# Altium schematic sheet ICs.SchDoc
size OrCAD C
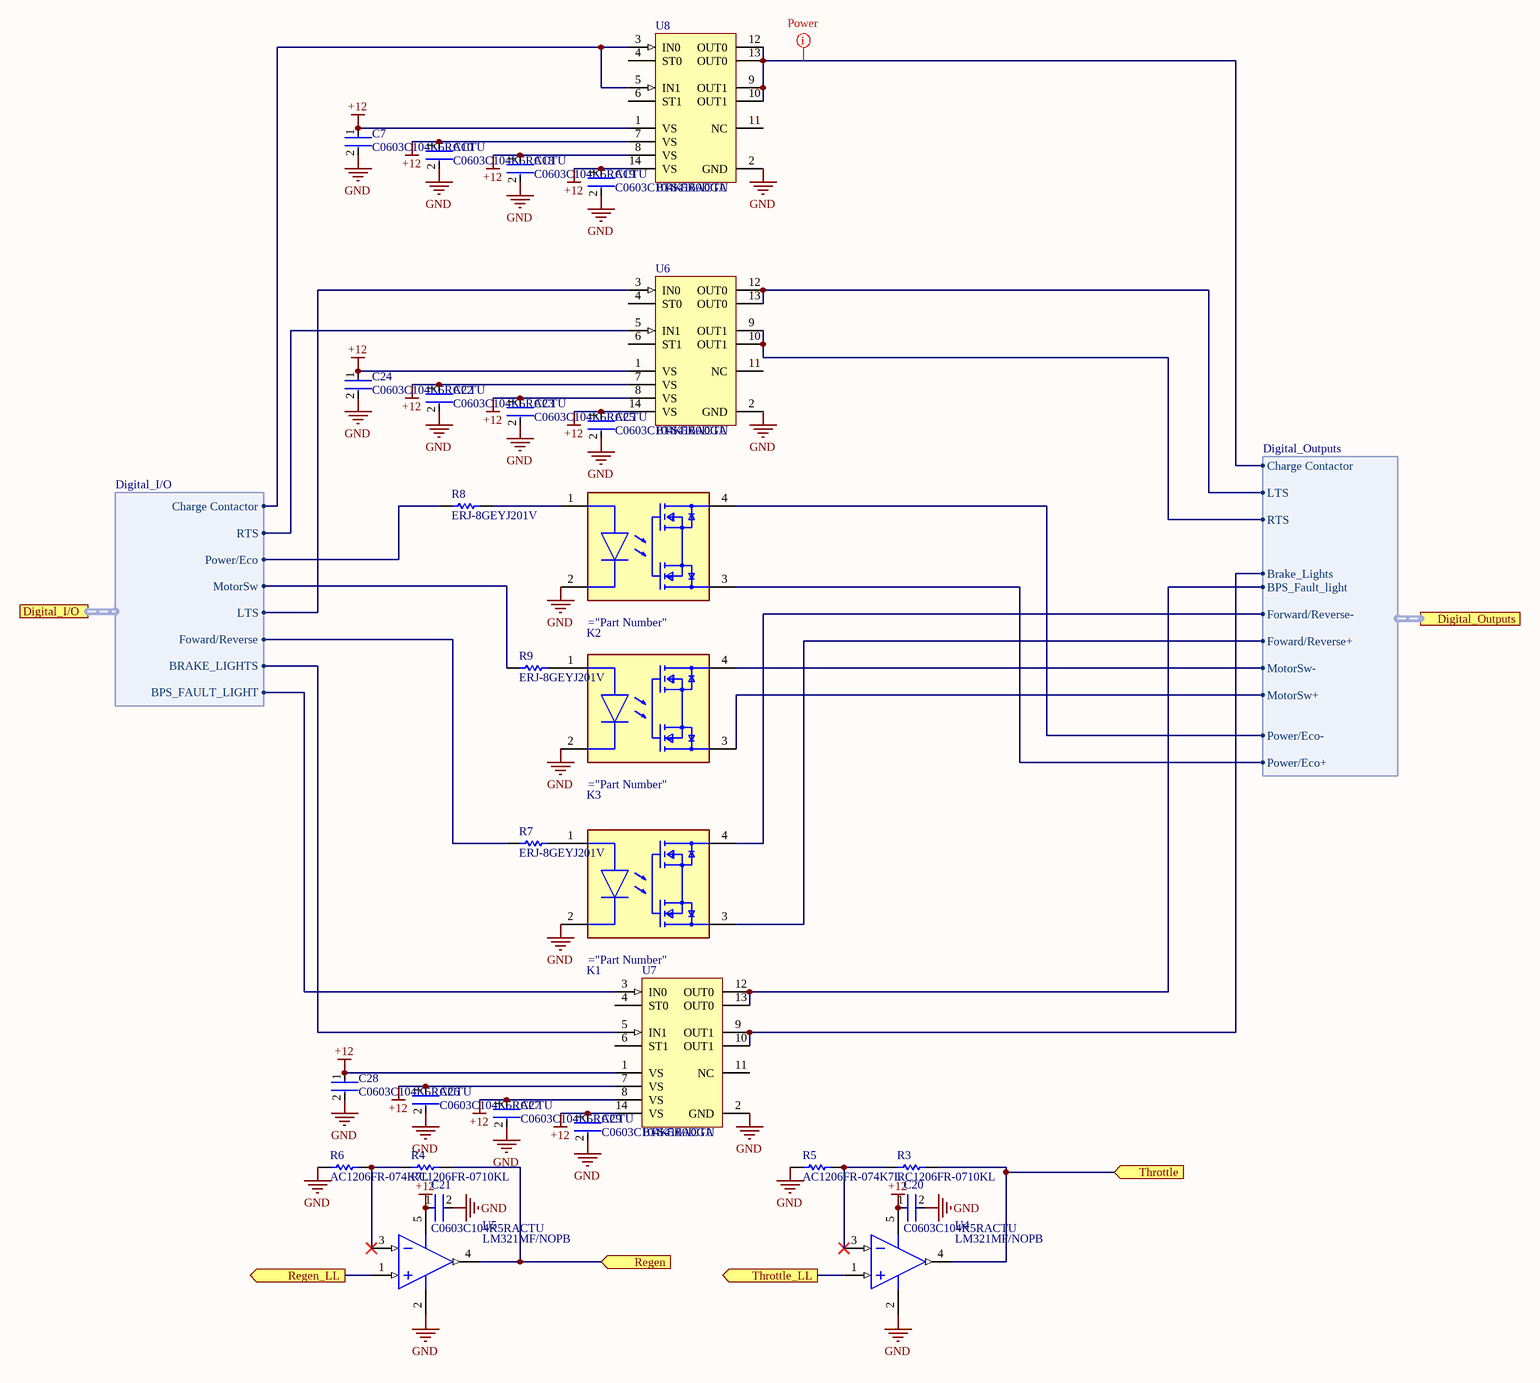
[diagram p0: ICs.SchDoc]

## Parts
C7  C0603C104K5RACTU  [Kemet_C0603_IPC_A]
C10  C0603C104K5RACTU  [Kemet_C0603_IPC_A]
C18  C0603C104K5RACTU  [Kemet_C0603_IPC_A]
C19  C0603C104K5RACTU  [Kemet_C0603_IPC_A]
C20  C0603C104K5RACTU  [Kemet_C0603_IPC_A]
C21  C0603C104K5RACTU  [Kemet_C0603_IPC_A]
C22  C0603C104K5RACTU  [Kemet_C0603_IPC_A]
C23  C0603C104K5RACTU  [Kemet_C0603_IPC_A]
C24  C0603C104K5RACTU  [Kemet_C0603_IPC_A]
C25  C0603C104K5RACTU  [Kemet_C0603_IPC_A]
C26  C0603C104K5RACTU  [Kemet_C0603_IPC_A]
C27  C0603C104K5RACTU  [Kemet_C0603_IPC_A]
C28  C0603C104K5RACTU  [Kemet_C0603_IPC_A]
C29  C0603C104K5RACTU  [Kemet_C0603_IPC_A]
K1  TLP3123_F  [Toshiba_11-5H1_0]  (value not drawn)
K2  TLP3123_F  [Toshiba_11-5H1_0]  (value not drawn)
K3  TLP3123_F  [Toshiba_11-5H1_0]  (value not drawn)
R3  RC1206FR-0710KL  [RESC3116X65X40ML10T20]
R4  RC1206FR-0710KL  [RESC3116X65X40ML10T20]
R5  AC1206FR-074K7L  [RESC3116X65X45NL10T20]
R6  AC1206FR-074K7L  [RESC3116X65X45NL10T20]
R7  ERJ-8GEYJ201V  [RESC3216X70X50LL05T20]
R8  ERJ-8GEYJ201V  [RESC3216X70X50LL05T20]
R9  ERJ-8GEYJ201V  [RESC3216X70X50LL05T20]
U4  LM321MF/NOPB  [DBV0005A_L]
U5  LM321MF/NOPB  [DBV0005A_L]
U6  BTS4160DGA  [INF-PG-DSO-14-37_N]
U7  BTS4160DGA  [INF-PG-DSO-14-37_N]
U8  BTS4160DGA  [INF-PG-DSO-14-37_N]

## Ports
Digital_I/O (harness Digital_I/O), Digital_Outputs (harness Digital_Outputs), Regen (in), Regen_LL (out), Throttle (in), Throttle_LL (out)

## Harnesses
Digital_I/O: BPS_FAULT_LIGHT, BRAKE_LIGHTS, Foward/Reverse, LTS, MotorSw, Power/Eco, RTS, Charge Contactor
Digital_Outputs: LTS, RTS, Power/Eco+, Power/Eco-, MotorSw+, MotorSw-, Foward/Reverse+, Forward/Reverse-, Brake_Lights, BPS_Fault_light, Charge Contactor

## Nets
+12: C7.1 C10.1 C18.1 C19.1 C20.1 C21.1 C22.1 C23.1 C24.1 C25.1 C26.1 C27.1 C28.1 C29.1 U4.5(V+) U5.5(V+) U6.1(VS) U6.7(VS) U6.8(VS) U6.14(VS) U7.1(VS) U7.7(VS) U7.8(VS) U7.14(VS) U8.1(VS) U8.7(VS) U8.8(VS) U8.14(VS)
GND: C7.2 C10.2 C18.2 C19.2 C20.2 C21.2 C22.2 C23.2 C24.2 C25.2 C26.2 C27.2 C28.2 C29.2 K1.2(C) K2.2(C) K3.2(C) R5.1 R6.1 U4.2(V-) U5.2(V-) U6.2(GND) U7.2(GND) U8.2(GND)
Regen: R4.2 U5.4(OUT) ; port Regen
Regen_LL: U5.1(IN+) ; port Regen_LL
Throttle: R3.2 U4.4(OUT) ; port Throttle
Throttle_LL: U4.1(IN+) ; port Throttle_LL
NetK1_1: K1.1(A) R7.2
NetK1_3: K1.3(1_DRAIN) ; port Digital_Outputs.Foward/Reverse+
NetK1_4: K1.4(2_DRAIN) ; port Digital_Outputs.Forward/Reverse-
NetK2_1: K2.1(A) R8.2
NetK2_3: K2.3(1_DRAIN) ; port Digital_Outputs.Power/Eco+
NetK2_4: K2.4(2_DRAIN) ; port Digital_Outputs.Power/Eco-
NetK3_1: K3.1(A) R9.2
NetK3_3: K3.3(1_DRAIN) ; port Digital_Outputs.MotorSw+
NetK3_4: K3.4(2_DRAIN) ; port Digital_Outputs.MotorSw-
NetR3_1: R3.1 R5.2 U4.3(IN-)
NetR4_1: R4.1 R6.2 U5.3(IN-)
NetR7_1: R7.1 ; port Digital_I/O.Foward/Reverse
NetR8_1: R8.1 ; port Digital_I/O.Power/Eco
NetR9_1: R9.1 ; port Digital_I/O.MotorSw
NetU6_3: U6.3(IN0) ; port Digital_I/O.LTS
NetU6_5: U6.5(IN1) ; port Digital_I/O.RTS
NetU6_9: U6.9(OUT1) U6.10(OUT1) ; port Digital_Outputs.RTS
NetU6_12: U6.12(OUT0) U6.13(OUT0) ; port Digital_Outputs.LTS
NetU7_3: U7.3(IN0) ; port Digital_I/O.BPS_FAULT_LIGHT
NetU7_5: U7.5(IN1) ; port Digital_I/O.BRAKE_LIGHTS
NetU7_9: U7.9(OUT1) U7.10(OUT1) ; port Digital_Outputs.Brake_Lights
NetU7_12: U7.12(OUT0) U7.13(OUT0) ; port Digital_Outputs.BPS_Fault_light
NetU8_3: U8.3(IN0) U8.5(IN1) ; port Digital_I/O.Charge Contactor
NetU8_9: U8.9(OUT1) U8.10(OUT1) U8.12(OUT0) U8.13(OUT0) ; port Digital_Outputs.Charge Contactor

Not connected (* = marked no-connect by the designer): U6 4(ST0) 6(ST1) 11(NC); U7 4(ST0) 6(ST1) 11(NC); U8 4(ST0) 6(ST1) 11(NC)

## Layout directives
net class Power: NetU8_9

## Library data of the parts
R3 R4 = CMP-2100-03676-1: Chip Resistor, 10 KOhm, +/- 1%, 0.25 W, -55 to 155 degC, 1206 (3216 Metric), RoHS, Tape and Reel; Manufacturer: Yageo; Voltage Rating: 200V; Resistance: 10KOhm; Temperature Coefficient: 100ppm/degreesC; Power Rating: 250mW; Packaging: TapeandReel; Termination: SMD/SMT; REACH SVHC: Unknown; Tolerance: 1%; Height: 0.55mm; Composition: ThickFilm; Max Operating Temperature: 155degC; Datasheet Version: Rev. 5, 10/2016; Lead Free: LeadFree; Case Code (Metric): 3216; Depth: 1.6mm; Package Quantity: 5000; RoHSCompliant: true; Military Standard: Not; Case/Package: 1206; Case Code (Imperial): 1206; Min Operating Temperature: -55degC; Datasheet URL: http://www.yageo.com/NewPortal/yageodocoutput?fileName=/pdf/R-Chip/PYu-RC_Group_51_RoHS_L_5.pdf; Length: 3.1mm; Manufacturer URL: http://www.yageo.com/; Package Reference: 1206.0; Width: 1.6mm; Package Description: 2-Pin Surface Mount Device, Body 3.1 x 1.6 mm
R5 R6 = CMP-2003-04896-1: Manufacturer: Yageo; Part Number: AC1206FR-074K7L
R7-R9 = CMP-2003-00580-1: Manufacturer: Panasonic; Part Number: ERJ-8GEYJ201V
U4 U5 = CMP-0055-01346-3: Low Power Single Op Amp, 5-pin SOT-23, Pb-Free; Manufacturer: Texas Instruments; PackageTopMarking: A63A*XTT; PowerWise: N; CompType: Amplifiers; ComponentLink1URL: http://www.ti.com/general/docs/lit/getliterature.tsp?genericPartNumber=LM321&fileType=pdf; PinCount: 5; RoHS: Y; ComponentLink1Description: Datasheet URL; PackageDescription: Molded SOT-23, .115 x .063 x .040 in Body, 5 Lead, .0375 in Pitch; Package Reference: DBV0005A
U6-U8 = BTS4160DGA: Smart High-Side Power Switch, 2 Channels, 1.7 A Load Current, -40 to 150 degC, PG-DSO-14-37, Reel, Green; Manufacturer: Infineon; Group: Automotive Qualified; RON(max) @ 150degreesC: 320 mOhm; Recommended Operating Voltage Min.: 5.5 V; Recommended Operating Voltage Max.: 20 V; Green: TRUE; toff (max): 270 us; Load Current (typ): 1.7 A; ton (max): 250 us; RON @ 25degreesC: 160 mOhm; Ptot (max): 1.4 W; Channels: 2; PartNumber: BTS4160DGA; ComponentLink1Description: Manufacturer URL; ComponentLink2Description: Datasheet; DatasheetVersion: Rev. 1.0; ComponentLink3URL: http://www.infineon.com/dgdl/BTS723GWDS11_2007_09_25.pdf?folderId=db3a304314dca389011537739e37155f&fileId=db3a304331c8f8560131dbfec21b0da9&sId=db3a30443d67b5ca013d854df2f133e5; ComponentLink1URL: http://www.infineon.com/; Packing: Reel; ComponentLink2URL: http://www.infineon.com/dgdl/BTS+4160DGA_DS2008_03_18_neu.pdf?folderId=db3a304314dca389011537739e37155f&fileId=db3a30431a5c32f2011a957ab5875685&sId=db3a30433d68e984013d7cba76cc57cb; ComponentLink3Description: Package Specification; PackageVersion: Sep-07; Halogen-free: TRUE; Mounting Technology: Surface Mount; PackageReference: PG-DSO-14-37; PackageDescription: 14-Pin Plastic (Green) Dual Small Outline Package, 8.65 x 3.9 mm Body, 1.27 mm Pitch